# EasyEDA Pro project ProPrj_Proj_mamba_2026-04-01.epro, schematic Schematic1
Assembly Variant: Basic; Board Name: Board1; Create Date: 2026-03-19; Page Name: P1; Project Name: Proj_mamba; Schematic Name: Schematic1; Update Date: 2026-03-19; BladeWidth: 10; Company: 嘉立创EDA; Page Size: A4; RegionStart: 1; ShowBorder: 1; TitleBlock: 1; TitleBlockPosition: 3; Version: V1.0; XRegionCount: 6; YRegionCount: 4
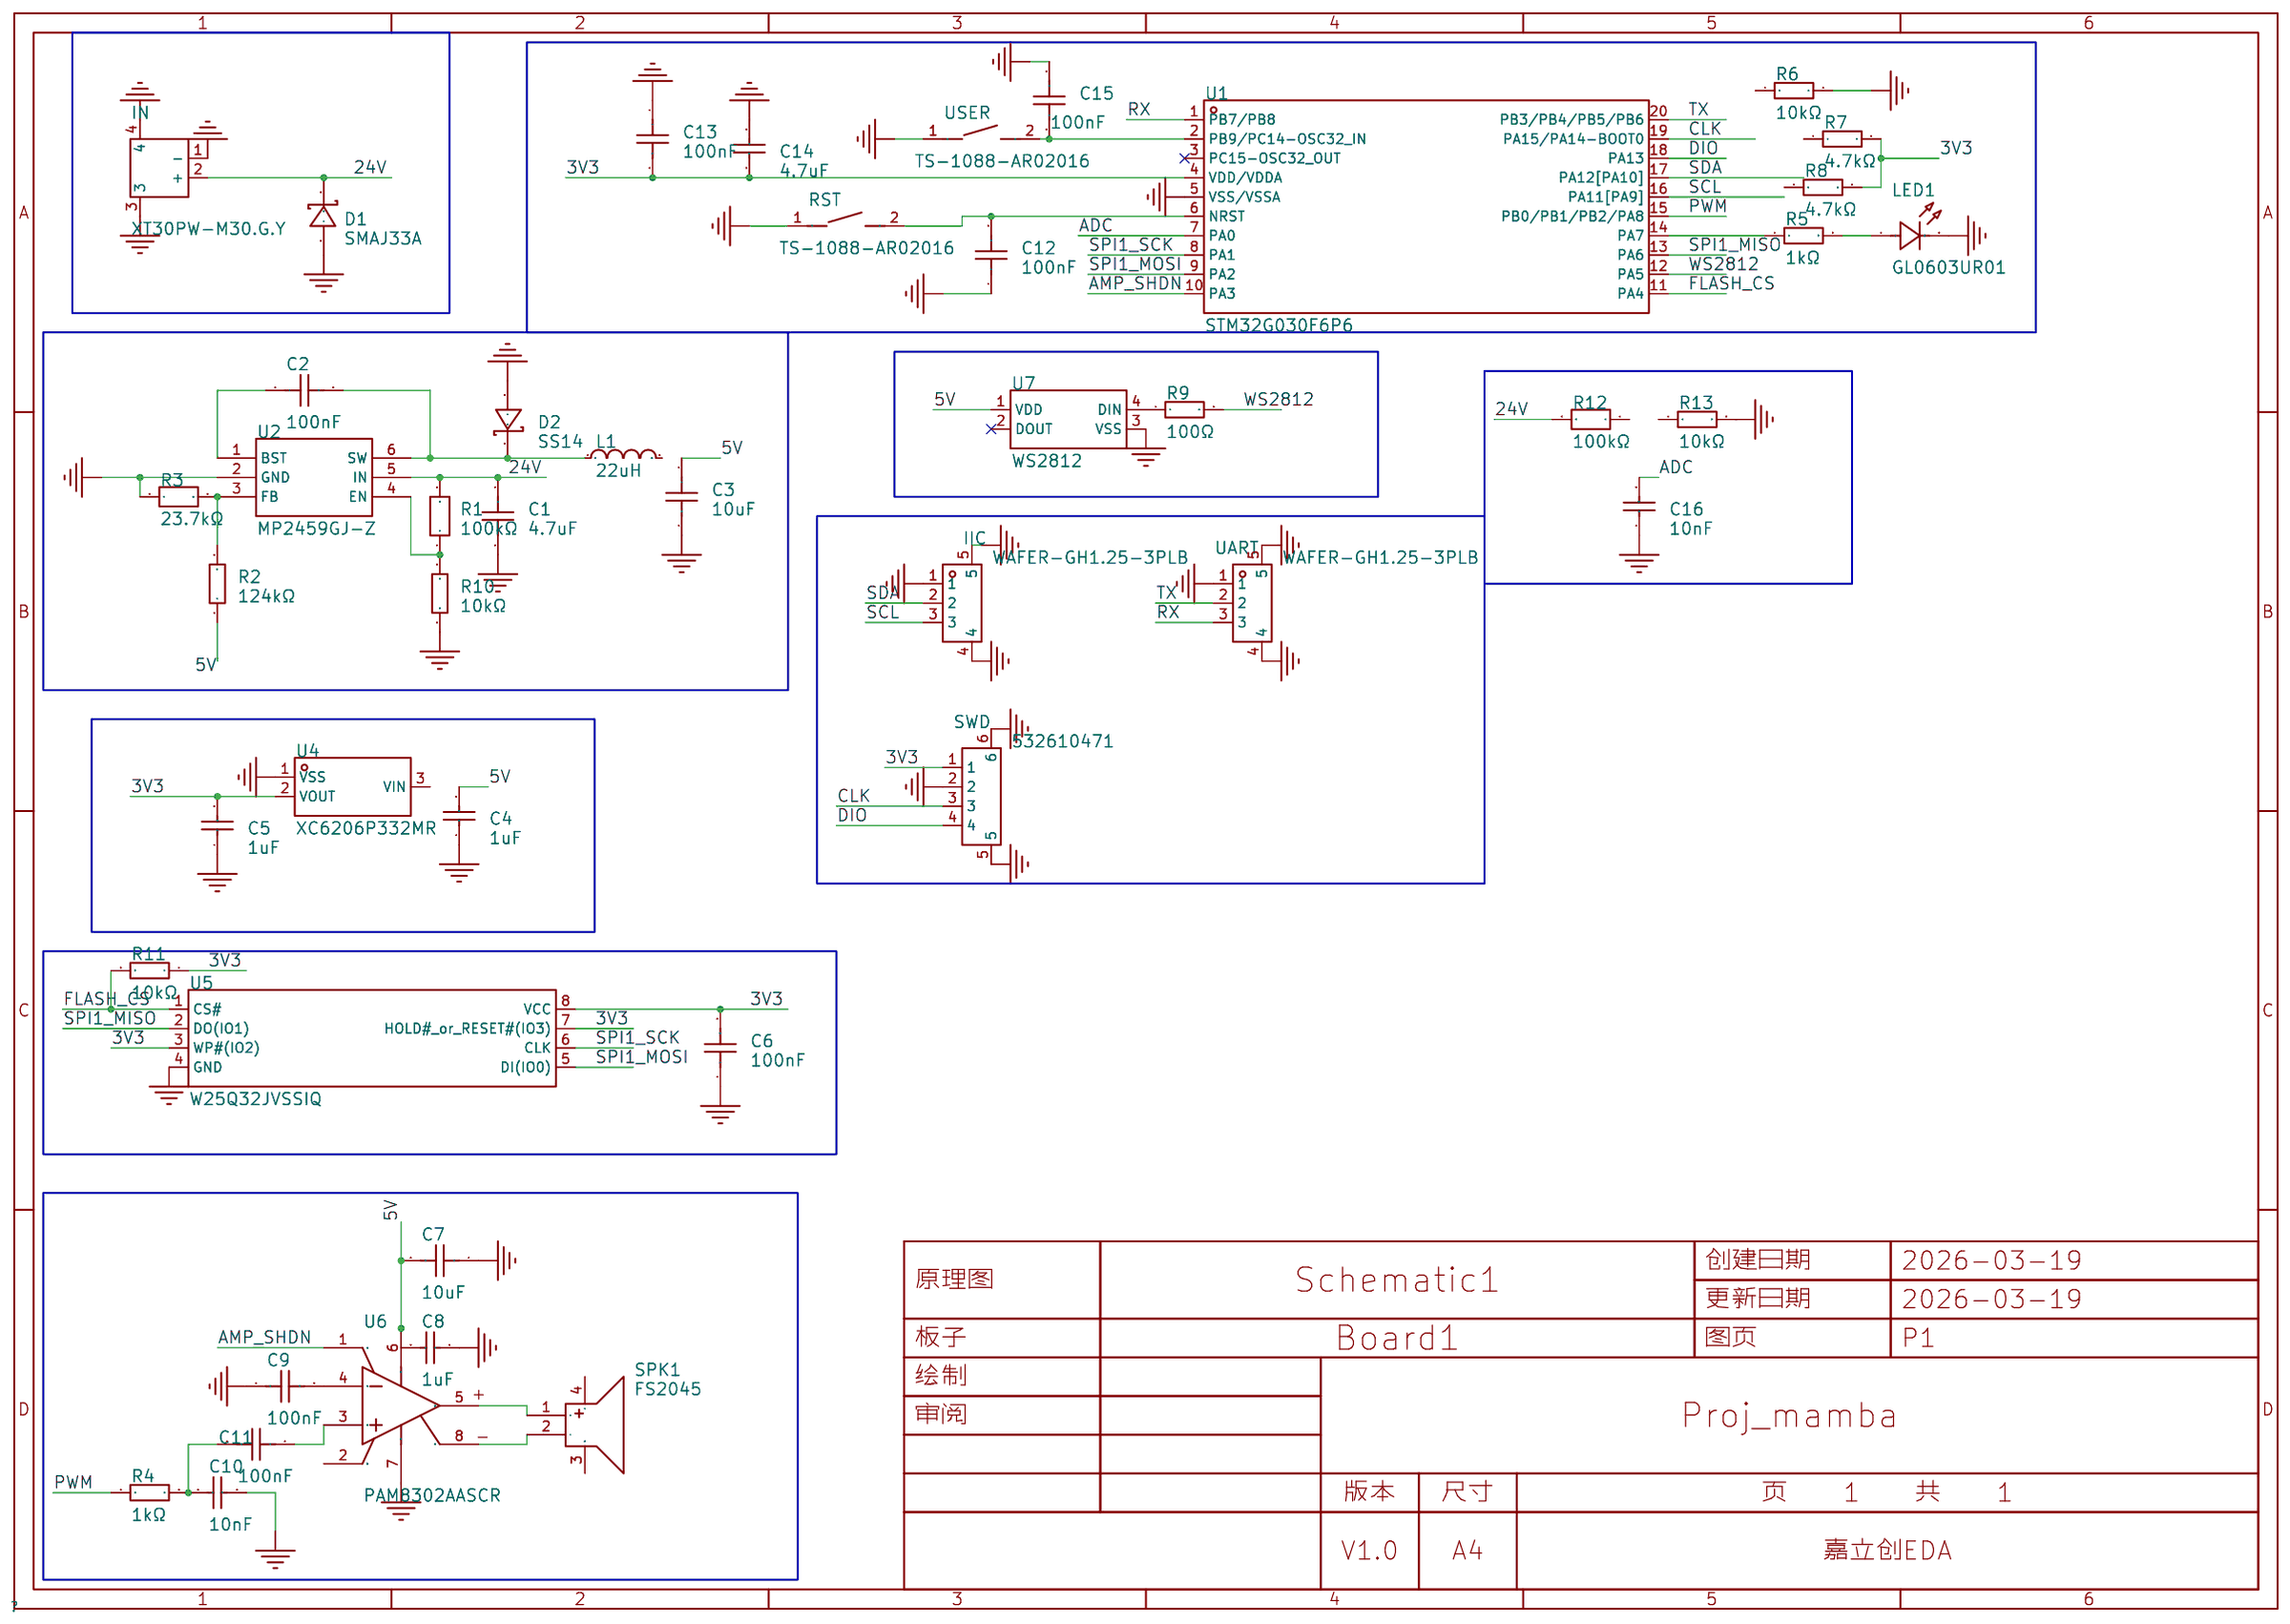
[diagram p1: schematic sheet]

## Parts
C1  4.7uF  [C0805]
C2  100nF  [C0805]
C3  10uF  [C0805]
C4  1uF  [C0805]
C5  1uF  [C0805]
C6  100nF  [C0805]
C7  10uF  [C0805]
C8  1uF  [C0805]
C9  100nF  [C0805]
C10  10nF  [C0805]
C11  100nF  [C0805]
C12  100nF  [C0805]
C13  100nF  [C0805]
C14  4.7uF  [C0805]
C15  100nF  [C0805]
C16  10nF  [C0805]
D1  SMAJ33A  [SMA_L4.3-W2.6-LS5.0-RD]
D2  SS14  [SMA_L4.3-W2.6-LS5.2-RD]
IIC  WAFER-GH1.25-3PLB  [CONN-SMD_3P-P1.25_XUNPU_WAFER-GH1.25-3PLB]
IN  XT30PW-M30.G.Y  [CONN-TH_XT30PW-M]
L1  22uH  [IND-SMD_L3.0-W3.0_FNR30XXS]
LED1  GL0603UR01  [LED0603-FD]
R1  100kΩ  [R0805]
R2  124kΩ  [R0805]
R3  23.7kΩ  [R0805]
R4  1kΩ  [R0805]
R5  1kΩ  [R0805]
R6  10kΩ  [R0805]
R7  4.7kΩ  [R0805]
R8  4.7kΩ  [R0805]
R9  100Ω  [R0805]
R10  10kΩ  [R0805]
R11  10kΩ  [R0805]
R12  100kΩ  [R0805]
R13  10kΩ  [R0805]
RST  TS-1088-AR02016  [SW-SMD_L3.9-W3.0-P4.45]
SPK1  FS2045  [BUZ-SMD_4P-L20.0-W20.0_FS2045]
SWD  532610471  [CONN-SMD_4P-P1.25_53261-0471]
U1  STM32G030F6P6  [TSSOP-20_L6.5-W4.4-P0.65-LS6.4-BL]
U2  MP2459GJ-Z  [SOT-23-6_L2.9-W1.6-P0.95-LS2.8-BR]
U4  XC6206P332MR  [SOT-23-3_L3.0-W1.7-P0.95-LS2.9-BR]
U5  W25Q32JVSSIQ  [SOIC-8_L5.3-W5.3-P1.27-LS8.0-BL]
U6  PAM8302AASCR  [MSOP-8_L3.0-W3.0-P0.65-LS5.0-BL]
U7  WS2812  [LED-SMD_4P-L5.0-W5.0-TL-A]
UART  WAFER-GH1.25-3PLB  [CONN-SMD_3P-P1.25_XUNPU_WAFER-GH1.25-3PLB]
USER  TS-1088-AR02016  [SW-SMD_L3.9-W3.0-P4.45]

## Library data of the parts
C1 = 0805X7R475K500NT: 容值:4.7uF;精度:±10%;额定电压:50V;温度系数:X7R;; LCSC Part Name: 4.7uF ±10% 50V; Supplier Part: C48579647; Manufacturer: AIDE(爱迪电容); Supplier Footprint: 0805; JLCPCB Part Class: Extended Part; Datasheet: https://item.szlcsc.com/datasheet/0805X7R475K500NT/50843387.html; Supplier: LCSC; Tolerance: ±10%; Voltage Rating: 50V; Temperature Coefficient: X7R
C2 C6 C9 C11-C13 C15 = FCC0805B104K500DT: 容值:100nF;精度:±10%;额定电压:50V;温度系数:X7R;; LCSC Part Name: 100nF ±10% 50V; Supplier Part: C5137467; Manufacturer: FOJAN(富捷); Supplier Footprint: 0805; JLCPCB Part Class: Extended Part; Datasheet: https://item.szlcsc.com/datasheet/FCC0805B104K500DT/5746969.html; Supplier: LCSC; Tolerance: ±10%; Voltage Rating: 50V; Temperature Coefficient: X7R
C3 C7 = CGA0805X5R106K500MT: 容值:10uF;精度:±10%;额定电压:50V;温度系数:X5R;; LCSC Part Name: 10uF ±10% 50V; Supplier Part: C6119889; Manufacturer: HRE(芯声); Supplier Footprint: 0805; JLCPCB Part Class: Extended Part; Datasheet: https://item.szlcsc.com/datasheet/CGA0805X5R106K500MT/7062595.html; Supplier: LCSC; Tolerance: ±10%; Voltage Rating: 50V; Temperature Coefficient: X5R
C4 C5 C8 = CL21B105KBFNNNE: 容值:1uF;精度:±10%;额定电压:50V;温度系数:X7R;; LCSC Part Name: 1uF ±10% 50V; Supplier Part: C28323; Manufacturer: SAMSUNG(三星); Supplier Footprint: 0805; JLCPCB Part Class: Basic Part; Datasheet: https://item.szlcsc.com/datasheet/CL21B105KBFNNNE/29074.html; Supplier: LCSC; Tolerance: ±10%; Voltage Rating: 50V; Temperature Coefficient: X7R
C10 C16 = CL21B103KBANNNC: 容值:10nF;精度:±10%;额定电压:50V;温度系数:X7R;; LCSC Part Name: 10nF ±10% 50V; Supplier Part: C1710; Manufacturer: SAMSUNG(三星); Supplier Footprint: 0805; JLCPCB Part Class: Basic Part; Datasheet: https://item.szlcsc.com/datasheet/CL21B103KBANNNC/2062.html; Supplier: LCSC; Tolerance: ±10%; Voltage Rating: 50V; Temperature Coefficient: X7R
C14 = CL21A475KBQNNNE: 容值:4.7uF;精度:±10%;额定电压:50V;温度系数:X5R;; LCSC Part Name: 4.7uF ±10% 50V; Supplier Part: C98192; Manufacturer: SAMSUNG(三星); Supplier Footprint: 0805; JLCPCB Part Class: Extended Part; Datasheet: https://item.szlcsc.com/datasheet/CL21A475KBQNNNE/99401.html; Supplier: LCSC; Tolerance: ±10%; Voltage Rating: 50V; Temperature Coefficient: X5R
D1 = SMAJ33A_C223988: 极性:单向;反向截止电压(Vrwm):33V;钳位电压:53.3V;峰值脉冲电流(Ipp):7.5A@10/1000us;峰值脉冲功率(Ppp):400W@10/1000us;击穿电压:40.6V;; LCSC Part Name: TVS 33V截止 7.5A峰值脉冲; Supplier Part: C223988; Manufacturer: Littelfuse(美国力特); Supplier Footprint: SMA(DO-214AC); JLCPCB Part Class: Extended Part; Datasheet: https://item.szlcsc.com/datasheet/SMAJ33A/224136.html; Supplier: LCSC; Polarity: 单向; Reverse Stand-Off Voltage (Vrwm): 33V; Clamping Voltage: 53.3V; Peak Pulse Current (Ipp): 7.5A@10/1000us; Peak Pulse Power Dissipation (Ppp): 400W@10/1000us; Voltage - Breakdown: 40.6V; Reverse Leakage Current (Ir): 1uA; Operating Temperature: -65℃~+150℃; level of protection: IEC 61000-4-2; Type: TVS
D2 = SS14_C83852: 正向压降(Vf):500mV@1A;直流反向耐压(Vr):40V;整流电流:1A;; LCSC Part Name: 电压:40V 电流:1A; Supplier Part: C83852; Manufacturer: onsemi(安森美); Supplier Footprint: SMA(DO-214AC); JLCPCB Part Class: Extended Part; Datasheet: https://item.szlcsc.com/datasheet/SS14/85019.html; Supplier: LCSC; Voltage - Forward(Vf@If): 500mV@1A; Voltage - DC Reverse(Vr): 40V; Current - Rectified: 1A; Reverse Leakage Current (Ir): 200uA@40V; Operating Junction Temperature Range: -65℃~+125℃; Non-Repetitive Peak Forward Surge Current: 40A
IIC UART = WAFER-GH1.25-3PLB: 插针结构:1x3P;间距:1.25mm;安装方式:立贴;参考系列:GH;总PIN数:3P;排数:1;每排PIN数:3;行距:-;额定电流:1A;触头材质:黄铜;触头镀层:锡;工作温度:-25℃~+85℃;; LCSC Part Name: 1x3P 间距:1.25mm 立贴 系列:GH; Supplier Part: C3029369; Manufacturer: XUNPU(讯普); Supplier Footprint: SMD,P=1.25mm; JLCPCB Part Class: Extended Part; Datasheet: https://item.szlcsc.com/datasheet/WAFER-GH1.25-3PLB/3561381.html; Supplier: LCSC; Pins Structure: 1x3P; Pitch: 1.25mm; Mounting Type: 立贴; Reference Series: GH; Number of Pins: 3P; Number of Rows: 1; Number of PINs Per Row: 3; Current Rating: 1A; Contact Material: 黄铜; Contact Plating: 锡; Operating Temperature: -25℃~+85℃; Voltage Rating: 125V; Plastic Material: LCP; Supplementary Features: 辅助焊脚; Color: 米色; Z-Height of the Board: 4.2mm; X-Length of Bottom Edge on Board (Spacing Line): 7mm; Y-Width of Bottom Edge on Board: 4.95mm
IN = XT30PW-M30.G.Y: Socket,DCsupply,XT30,male,PIN:2; LCSC Part Name: AMASS(艾迈斯)航模插头 卧式弯脚 XT30PW-M公头; Supplier Part: C431092; Manufacturer: AMASS(艾迈斯); JLCPCB Part Class: Extended Part; Datasheet: https://item.szlcsc.com/datasheet/XT30PW-M30.G.Y/426930.html; Supplier: LCSC; Rated current: 15A; Rated voltage: 500VDC; Connector type: 航模插头; Wire gauge: 16/18/20AWG; contact resistance: 1.2mΩ; Size/Specification: 2pin; interface form: 公头
L1 = FNR3015S220MT: 电感值:22uH;精度:±20%;额定电流:690mA;饱和电流(Isat):680mA;; LCSC Part Name: 22uH ±20% 680mA; Supplier Part: C167761; Manufacturer: cjiang(长江微电); Supplier Footprint: SMD,3x3mm; JLCPCB Part Class: Extended Part; Datasheet: https://atta.szlcsc.com/upload/public/pdf/source/20190327/C167925_9EFF0AABC4CA629C2CC95961DBF7D39D.pdf; Supplier: LCSC; Tolerance: ±20%; Rated Current: 690mA; Saturation Current (Isat): 680mA; DC Resistance (DCR): 598mΩ
LED1 = GL0603UR01: 发光颜色:红色;正向压降(Vf):2.4V;正向电流:20mA;波长:620nm~625nm;二极管配置:独立二极管;透镜颜色:无色透明透镜;发光强度:120mcd;发光角度:120°;载带方式:正贴;工作温度:-40℃~+85℃;; LCSC Part Name: 0603 红灯 高亮; Supplier Part: C51933292; Manufacturer: Guiguang light(桂光光电); Supplier Footprint: 0603; JLCPCB Part Class: Extended Part; Datasheet: https://item.szlcsc.com/datasheet/GL0603UR01/54645988.html; Supplier: LCSC; Illumination Color: 红色; Voltage - Forward(Vf): 2.4V; Forward Current: 20mA; Wavelength - Dominant: 620nm~625nm; Diode Configuration: 独立二极管; Lens Color: 无色透明透镜; Luminous Intensity: 120mcd; Viewing Angle: 120°; Mounting Style: 正贴; Operating Temperature: -40℃~+85℃
R1 R12 = PTFR0805Q100KP9: 电阻类型:薄膜电阻;阻值:100kΩ;精度:±0.02%;功率:130mW;工作电压:150V;温度系数:±25ppm/℃;; LCSC Part Name: 薄膜电阻 100kΩ ±0.02% 130mW; Supplier Part: C42404624; Manufacturer: RESI(开步睿思); Supplier Footprint: 0805; Datasheet: https://item.szlcsc.com/datasheet/PTFR0805Q100KP9/44369429.html; Supplier: LCSC; Type: 薄膜电阻; Tolerance: ±0.02%; Power(Watts): 130mW; Voltage-Supply(Max): 150V; Temperature Coefficient: ±25ppm/℃; Operating Temperature: -55℃~+155℃
R2 = 0805W8F1243T5E: 电阻类型:厚膜电阻;阻值:124kΩ;精度:±1%;功率:125mW;工作电压:150V;温度系数:±100ppm/℃;; LCSC Part Name: 124kΩ ±1% 125mW 厚膜电阻; Supplier Part: C17440; Manufacturer: UNI-ROYAL(厚声); Supplier Footprint: 0805; JLCPCB Part Class: Extended Part; Datasheet: https://item.szlcsc.com/datasheet/0805W8F1243T5E/18128.html; Supplier: LCSC; Type: 厚膜电阻; Tolerance: ±1%; Power(Watts): 125mW; Voltage-Supply(Max): 150V; Temperature Coefficient: ±100ppm/℃; Operating Temperature: -55℃~+155℃
R3 = PTFR0805B23K7P9: 电阻类型:薄膜电阻;阻值:23.7kΩ;精度:±0.1%;功率:130mW;工作电压:150V;温度系数:±25ppm/℃;; LCSC Part Name: 薄膜电阻 23.7kΩ ±0.1% 130mW; Supplier Part: C2849117; Manufacturer: RESI(开步睿思); Supplier Footprint: 0805; JLCPCB Part Class: Extended Part; Datasheet: https://item.szlcsc.com/datasheet/PTFR0805B23K7P9/3048532.html; Supplier: LCSC; Type: 薄膜电阻; Tolerance: ±0.1%; Power(Watts): 130mW; Voltage-Supply(Max): 150V; Temperature Coefficient: ±25ppm/℃; Operating Temperature: -55℃~+155℃
R4 R5 = 0805W8F1001T5E: 电阻类型:厚膜电阻;阻值:1kΩ;精度:±1%;功率:125mW;最大工作电压:150V;温度系数:±100ppm/℃;; LCSC Part Name: 1kΩ ±1% 125mW 厚膜电阻; Supplier Part: C17513; Manufacturer: UNI-ROYAL(厚声); Supplier Footprint: 0805; JLCPCB Part Class: Basic Part; Datasheet: https://atta.szlcsc.com/upload/public/pdf/source/20200306/C422600_1E6D84923E4A46A82E41ADD87F860B5C.pdf; Supplier: LCSC; Type: 厚膜电阻; Tolerance: ±1%; Power(Watts): 125mW; Overload Voltage (Max): 150V; Temperature Coefficient: ±100ppm/℃; Operating Temperature Range: -55℃~+155℃
R6 R10 R11 R13 = 0805W8F1002T5E_C17414: 电阻类型:厚膜电阻;阻值:10kΩ;精度:±1%;功率:125mW;工作电压:150V;温度系数:±100ppm/℃;; LCSC Part Name: 10kΩ ±1% 125mW 厚膜电阻; Supplier Part: C17414; Manufacturer: UNI-ROYAL(厚声); Manufacturer Part: 0805W8F1002T5E; Supplier Footprint: 0805; JLCPCB Part Class: Basic Part; Datasheet: https://item.szlcsc.com/datasheet/0805W8F1002T5E/18102.html; Supplier: LCSC; Type: 厚膜电阻; Tolerance: ±1%; Power(Watts): 125mW; Voltage-Supply(Max): 150V; Temperature Coefficient: ±100ppm/℃; Operating Temperature: -55℃~+155℃
R7 R8 = 0805W8F4701T5E: 电阻类型:厚膜电阻;阻值:4.7kΩ;精度:±1%;功率:125mW;最大工作电压:150V;温度系数:±100ppm/℃;; LCSC Part Name: 4.7kΩ ±1% 125mW 厚膜电阻; Supplier Part: C17673; Manufacturer: UNI-ROYAL(厚声); Supplier Footprint: 0805; JLCPCB Part Class: Basic Part; Datasheet: https://atta.szlcsc.com/upload/public/pdf/source/20200306/C422600_1E6D84923E4A46A82E41ADD87F860B5C.pdf; Supplier: LCSC; Type: 厚膜电阻; Tolerance: ±1%; Power(Watts): 125mW; Overload Voltage (Max): 150V; Temperature Coefficient: ±100ppm/℃; Operating Temperature Range: -55℃~+155℃
R9 = 0805W8F1000T5E: 电阻类型:厚膜电阻;阻值:100Ω;精度:±1%;功率:125mW;最大工作电压:150V;温度系数:±100ppm/℃;; LCSC Part Name: 100Ω ±1% 125mW 厚膜电阻; Supplier Part: C17408; Manufacturer: UNI-ROYAL(厚声); Supplier Footprint: 0805; JLCPCB Part Class: Basic Part; Datasheet: https://atta.szlcsc.com/upload/public/pdf/source/20200306/C422600_1E6D84923E4A46A82E41ADD87F860B5C.pdf; Supplier: LCSC; Type: 厚膜电阻; Tolerance: ±1%; Power(Watts): 125mW; Overload Voltage (Max): 150V; Temperature Coefficient: ±100ppm/℃; Operating Temperature Range: -55℃~+155℃
RST USER = TS-1088-AR02016: 电路结构:单刀单掷;按钮形状:圆形按钮;作用力:1.6N;安装方式:立贴;开关长度:4mm;开关宽度:3mm;开关高度:2mm;带支架:不带支架;触点电流:50mA;额定电压:12V;工作寿命:10万次;; LCSC Part Name: 4*3*2mm 立贴 轻触开关; Supplier Part: C720477; Manufacturer: XUNPU(讯普); Supplier Footprint: SMD,4x3mm; JLCPCB Part Class: Basic Part; Datasheet: https://item.szlcsc.com/datasheet/TS-1088-AR02016/763484.html; Supplier: LCSC; Circuit: 单刀单掷; Actuator Style: 圆形按钮; Operating Force: 1.6N; Mounting Type: 立贴; Length: 4mm; Width: 3mm; Switch Height: 2mm; with Bracket: 不带支架; Contact Current: 50mA; Voltage Rating: 12V; Actuator/Cap Color: 黑色; Termination Style: SMD接片; Life: 10万次; Operating Temperature: -30℃~+80℃
SPK1 = FS2045: Supplier Part: C2972853; Manufacturer: FUET(福声科技); JLCPCB Part Class: Extended Part; Datasheet: https://item.szlcsc.com/datasheet/FS2045/3368446.html; Supplier: LCSC
SWD = 532610471_C696092: 插针结构:1x4P;间距:1.25mm;安装方式:卧贴;参考系列:PicoBlade(MX 1.25);总PIN数:4P;排数:1;每排PIN数:4;行距:-;额定电流:1A;触头材质:磷青铜;触头镀层:锡;工作温度:-40℃~+105℃;; LCSC Part Name: 1x4P 间距:1.25mm 卧贴 系列:PicoBlade(MX 1.25); Supplier Part: C696092; Manufacturer: MOLEX; Supplier Footprint: SMD,P=1.25mm,卧贴; JLCPCB Part Class: Extended Part; Datasheet: https://www.molex.com/content/dam/molex/molex-dot-com/products/automated/en-us/salesdrawingpdf/532/53261/532610471_sd.pdf?inline\; Supplier: LCSC; Pins Structure: 1x4P; Pitch: 1.25mm; Mounting Type: 卧贴; Reference Series: PicoBlade(MX 1.25); Number of Pins: 4P; Number of Rows: 1; Number of PINs Per Row: 4; Current Rating: 1A; Contact Material: 磷青铜; Contact Plating: 锡; Operating Temperature: -40℃~+105℃; Voltage Rating: 125V; Plastic Material: 玻纤增强PA; Flame Retardant Rating: UL94V-0; Supplementary Features: 辅助焊脚; Color: 白色; Z-Height of the Board: 3.4mm; X-Length of Bottom Edge on Board (Spacing Line): 10.15mm; Y-Width of Bottom Edge on Board: 5.2mm
U1 = STM32G030F6P6: CPU内核:ARM-M0;CPU最大主频:64MHz;应用领域:-;; LCSC Part Name: 主流超值系列Arm Cortex-M0+ MCU，具有32 KB Flash存储器、8 KB RAM、64 MHz CPU、2x USART、定时器、ADC和通信接口，2-3.6V; Supplier Part: C724040; Manufacturer: ST(意法半导体); Supplier Footprint: TSSOP-20; JLCPCB Part Class: Extended Part; Datasheet: https://item.szlcsc.com/datasheet/STM32G030F6P6/769428.html; Supplier: LCSC; CPU Core: ARM-M0; CPU Maximum Speed: 64MHz; Program Storage Size: 32KB; Program Memory Type: FLASH; Number of I/O: 18; ADC (Bit): 12bit; Voltage - Supply: 2V~3.6V
U2 = MP2459GJ-Z: 功能类型:降压型;工作电压:4.5V~55V;输出电压:-;输出电流:500mA;输出类型:可调;; LCSC Part Name: 0.5A、55V、480kHz降压转换器; Supplier Part: C39578; Manufacturer: MPS(芯源); Supplier Footprint: TSOT-23-6; JLCPCB Part Class: Extended Part; Datasheet: https://item.szlcsc.com/datasheet/MP2459GJ-Z/40561.html; Supplier: LCSC; Function: 降压型; Voltage - Supply: 4.5V~55V; Output Current: 500mA; Frequency - Switching: 480kHz; Operating Temperature: -40℃~+125℃@(TJ); Synchronous Rectifier: 否; Number of Outputs: 1; Topology: 降压式; Quiescent Current: 730uA; Switch tube (built-in/external): 内置; Output Type: 可调
U4 = XC6206P332MR_C347376: 输出类型:固定;工作电压:8V;输出电压:3.3V;输出电流:250mA;电源纹波抑制比(PSRR):40dB@(1kHz);输出极性:正极;; LCSC Part Name: 高纹波抑制率、低功耗、低压差 CMOS 降压型电压稳压器; Supplier Part: C347376; Manufacturer: UMW(友台半导体); Supplier Footprint: SOT-23; JLCPCB Part Class: Extended Part; Datasheet: https://item.szlcsc.com/datasheet/XC6206P332MR/324036.html; Supplier: LCSC; Output Type: 固定; Voltage - Supply: 8V; Output Voltage: 3.3V; Output Current: 250mA; Power Supply Rejection Ratio (PSRR): 40dB@(1kHz); Voltage Dropout: 240mV@(50mA); standby current: 7uA; Features: 过流保护；短路保护; Operating Temperature: -25℃~+80℃@(Ta); Output Configuration: 正极; Number of Outputs: 1
U5 = W25Q32JVSSIQ: 接口类型:SPI;存储容量:32Mbit;时钟频率(fc):133MHz;; LCSC Part Name: 支持双线、四线SPI接口的3V、32Mbit 串行SPI闪存; Supplier Part: C179173; Manufacturer: Winbond(华邦); Supplier Footprint: SOIC-8-208mil; JLCPCB Part Class: Extended Part; Datasheet: https://item.szlcsc.com/datasheet/W25Q32JVSSIQ/190567.html; Supplier: LCSC; Interface: SPI; Memory Size: 32Mbit; Clock Frequency: 133MHz; Voltage - Supply: 2.7V~3.6V; Standby Supply Current: 1uA; Program / Erase Cycles: 100000次; Page Programming Time (Tpp): 3ms; Data Retention - TDR (Year): 20年; Operating Temperature: -40℃~+85℃
U6 = PAM8302AASCR: 功放类型:D类功放;扬声器通道数:单声道;输出功率:2.5Wx1@4Ω;静态电流(Iq):4mA;; LCSC Part Name: 2.5W单声道D类音频功率放大器; Supplier Part: C113367; Manufacturer: DIODES(美台); Supplier Footprint: MSOP-8; JLCPCB Part Class: Extended Part; Datasheet: https://item.szlcsc.com/datasheet/PAM8302AASCR/114602.html; Supplier: LCSC; Class: D类功放; Speaker Channels: 单声道; Output Power: 2.5Wx1@4Ω; Voltage - Supply: 2V~5.5V; Total Harmonic Distortion + Noise (THD+N): 0.3%; Quiescent Current: 4mA; Operating Temperature: -40℃~+85℃; Signal-to-Noise Ratio: 80dB; Power Supply Rejection Ratio (PSRR): 50dB; Efficiency: 85%
U7 = WS2812: RGB三色灯珠，5050RGB集成光源内置IC幻彩灯珠单点单控5V，高性价比，12mA; Supplier Part: C42417498; Manufacturer: worldsemi; Supplier Footprint: SMD5050-4P; JLCPCB Part Class: Extended Part; Datasheet: https://item.szlcsc.com/datasheet/WS2812/44423158.html; Supplier: LCSC

## Nets
3V3: C5.2 C6.2 C13.2 C14.2 R7.2 R8.2 R11.1 SWD.1 U1.4(VDD/VDDA) U4.2(VOUT) U5.3(WP#(IO2)) U5.7(HOLD# or RESET#(IO3)) U5.8(VCC)
5V: C3.2 C4.2 C7.2 C8.2 L1.2 R2.1 U4.3(VIN) U6.6(VDD) U7.1(VDD)
24V: C1.1 D1.1(K) IN.2(+) R1.2 R12.2 U2.5(IN)
GND: C1.2 C3.1 C4.1 C5.1 C6.1 C7.1 C8.1 C9.1 C10.2 C12.1 C13.1 C14.1 C15.1 C16.1 D1.2(A) D2.2(A) IIC.1 IIC.4 IIC.5 IN.1(-) IN.3 IN.4 LED1.2(C) R3.1 R6.2 R10.1 R13.2 RST.1 SWD.2 SWD.5 SWD.6 U1.5(VSS/VSSA) U2.2(GND) U4.1(VSS) U5.4(GND) U6.7(GND) U7.3(VSS) UART.1 UART.4 UART.5 USER.1
ADC: C16.2 R12.1 R13.1 U1.7(PA0)
AMP_SHDN: U1.10(PA3) U6.1(SD#)
CLK: R6.1 SWD.3 U1.19(PA15/PA14-BOOT0)
DIO: SWD.4 U1.18(PA13)
FLASH_CS: R11.2 U1.11(PA4) U5.1(CS#)
PWM: R4.1 U1.15(PB0/PB1/PB2/PA8)
RX: U1.1(PB7/PB8) UART.3
SCL: IIC.3 R8.1 U1.16(PA11[PA9])
SDA: IIC.2 R7.1 U1.17(PA12[PA10])
SPI1_MISO: U1.13(PA6) U5.2(DO(IO1))
SPI1_MOSI: U1.9(PA2) U5.5(DI(IO0))
SPI1_SCK: U1.8(PA1) U5.6(CLK)
TX: U1.20(PB3/PB4/PB5/PB6) UART.2
WS2812: R9.2 U1.12(PA5)
$1N8: R1.1 R10.2 U2.4(EN)
$1N12: C2.2 D2.1(K) L1.1 U2.6(SW)
$1N14: C2.1 U2.1(BST)
$1N17: R2.2 R3.2 U2.3(FB)
$1N39: C9.2 U6.4(IN-)
$1N40: SPK1.1(+) U6.5(VO+)
$1N41: SPK1.2(-) U6.8(VO-)
$1N45: C10.1 C11.1 R4.2
$1N46: C11.2 U6.3(IN+)
$1N52: C12.2 RST.2 U1.6(NRST)
$1N56: C15.2 U1.2(PB9/PC14-OSC32_IN) USER.2
$1N70: R5.1 U1.14(PA7)
$1N71: LED1.1(A) R5.2
$1N80: R9.1 U7.4(DIN)

Not connected (* = marked no-connect by the designer): SPK1 3 4; U1 3(PC15-OSC32_OUT)*; U6 2(NC); U7 2(DOUT)*
